# Altium schematic sheet CC-S06-V00-DigitalIn.SchDoc: Input Protection (Digital)
size A3; DrawnBy: Jonn Dillon; DocumentNumber: 7; SheetNumber: 7; SheetTotal: 13; Project: Chassis Controller (Interim) 2020
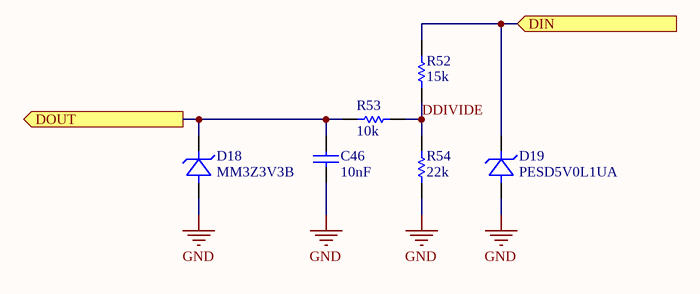
[diagram p0: CC-S06-V00-DigitalIn.SchDoc]

## Parts
C46  10nF  [Cap_Ceramic_0603]
D18  MM3Z3V3B  [SOD323F]
D19  PESD5V0L1UA  [SOD323F]
R52  15k  [Res_ThinFilm_0603]
R53  10k  [Res_ThinFilm_0603]
R54  22k  [Res_ThinFilm_0603]

## Ports
DIN (in), DOUT (out)

## Nets
GND: C46.1 D18.A(Anode) D19.A(Anode) R54.1
DDIVIDE: R52.1 R53.2 R54.2
DIN: D19.K(Cathode) R52.2 ; port DIN
DOUT: C46.2 D18.K(Cathode) R53.1 ; port DOUT

## Notes on the sheet
- Revision History:
- Sheet Title:
- Rev
- Date
- Description
- Project:
- Size:
- Drawn By:
- A3
- Number:
- Revision:
- Sheet
- Version:
- of
- QUT Motorsport
- O-120, Gardens Point
- 2 George Street
- Brisbane, QLD 4000
- Australia
- Print Date:
- Print Time:
- File Name:

## Library data of the parts
C46 = 10nF 50V 5% X7R 0603: Capacitor, Ceramic, SMD, 10nF, 50V, 5%, X7R, 0603
D18 = MM3Z3V3B: Diode, SMD, Zenner, 3.3V, 2%, 410mW, SOD-323F; ComponentLink1Description: Digikey; ComponentLink1URL: https://www.digikey.com.au/product-detail/en/on-semiconductor/MM3Z3V3B/MM3Z3V3BCT-ND/1626881
D19 = PESD5V0L1UA: 12V Clamp 3.5A (8/20µs) Ipp Tvs Diode Surface Mount SOD-323
R52 = 15k 5% 0603: Resistor, SMD, 15k, 0.1W, 5%, 0603
R53 = 10k 5% 0603: Resistor, SMD, 10k, 0.1W, 5%, 0603
R54 = 22k 5% 0603: Resistor, SMD, 22k, 0.1W, 5%, 0603